# Altium project esp32-web-radio.PrjPcb
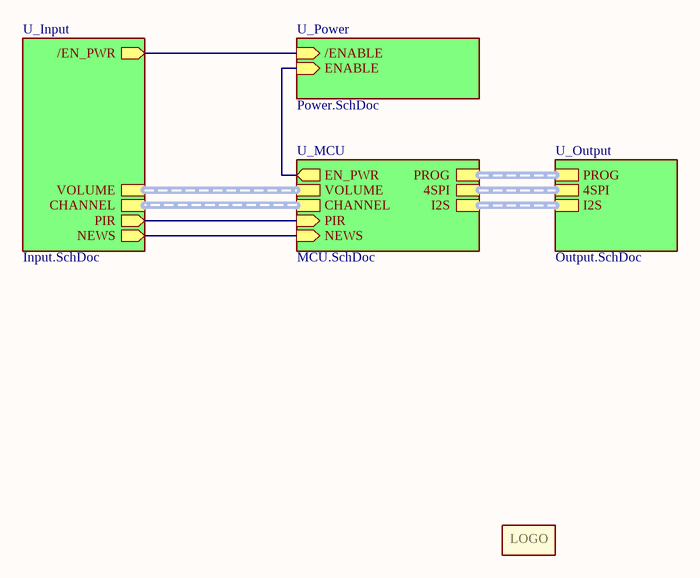
[diagram p0: Main.SchDoc]
assembly_revision: 0; board_name: WEBRAD; board_revision: 1.1; Project_link: https://github.com/LieBtrau/esp32-web-radio
5 sheets, 118 parts. Net scope: hierarchical (ports join the sheet entries above them; power ports are global).
Board file: esp32-web-radio.PcbDoc
Sheets:
  Main.SchDoc
    U_Input = Input.SchDoc
    U_MCU = MCU.SchDoc
    U_Output = Output.SchDoc
    U_Power = Power.SchDoc

## Sheet Main.SchDoc: Top level
size A4; Engineer: CT; SheetNumber: 1; SheetTotal: 5

### Parts
M1  Logo  [LOGO_9x6mm]  (value not drawn)  (no BOM)

### Sub-sheets
U_Input = Input.SchDoc: /EN_PWR (out), VOLUME (harness ROTENC), CHANNEL (harness ROTENC), PIR (out), NEWS (out)
U_MCU = MCU.SchDoc: 4SPI (harness 4SPI), PROG (harness PROG), VOLUME (harness ROTENC), CHANNEL (harness ROTENC), PIR (in), EN_PWR (out), NEWS (in), I2S (harness I2S)
U_Output = Output.SchDoc: PROG (harness PROG), 4SPI (harness 4SPI), I2S (harness I2S)
U_Power = Power.SchDoc: /ENABLE (in), ENABLE (in)

### Nets
/EN_PWR: sheet U_Input//EN_PWR, sheet U_Power//ENABLE
EN_PWR: sheet U_MCU/EN_PWR, sheet U_Power/ENABLE
NEWS: sheet U_Input/NEWS, sheet U_MCU/NEWS
PIR: sheet U_Input/PIR, sheet U_MCU/PIR

### Buses and harness runs
harness sheet U_Input/CHANNEL = sheet U_MCU/CHANNEL
harness sheet U_Input/VOLUME = sheet U_MCU/VOLUME
harness sheet U_MCU/4SPI = sheet U_Output/4SPI
harness sheet U_MCU/I2S = sheet U_Output/I2S
harness sheet U_MCU/PROG = sheet U_Output/PROG

### Notes on the sheet
- Title
- Sheet Revision:
- Link:
- Size:
- Project:
- Engineer:
- A4
- Date:
- Sheet
- of
- File:
- (in symbol Logo) LOGO

## Sheet Input.SchDoc: Inputs
size A4; Engineer: CT; SheetNumber: 5; SheetTotal: 5
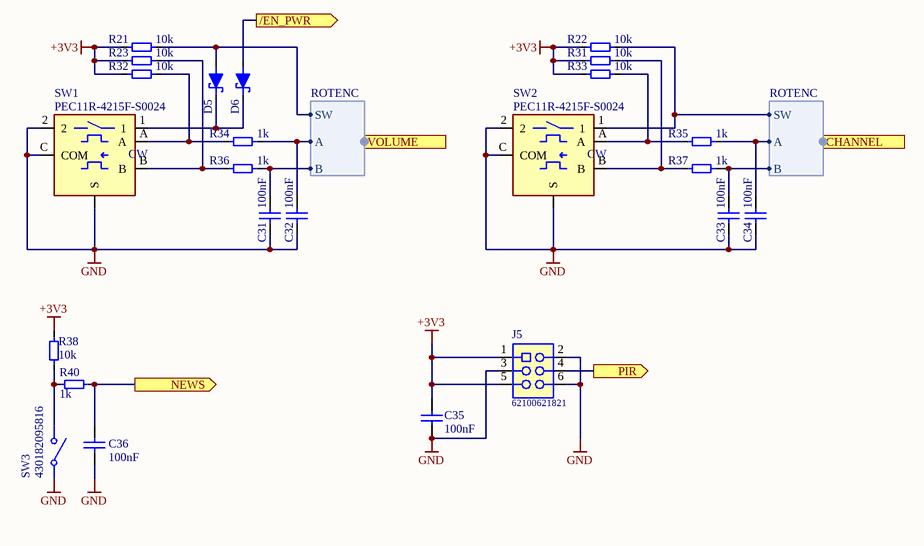
[diagram p1: Input.SchDoc]

### Parts
C31  value 100nF  [0603-C-N]  (hidden comment: Capacitor 100nF +/-10% 50V X7R 0603)
C32  value 100nF  [0603-C-N]  (hidden comment: Capacitor 100nF +/-10% 50V X7R 0603)
C33  value 100nF  [0603-C-N]  (hidden comment: Capacitor 100nF +/-10% 50V X7R 0603)
C34  value 100nF  [0603-C-N]  (hidden comment: Capacitor 100nF +/-10% 50V X7R 0603)
C35  value 100nF  [0603-C-N]  (hidden comment: Capacitor 100nF +/-10% 50V X7R 0603)
C36  value 100nF  [0603-C-N]  (hidden comment: Capacitor 100nF +/-10% 50V X7R 0603)
D5  1PS79SB30,115  [FP-SOD523-MFG]  (value not drawn)
D6  1PS79SB30,115  [FP-SOD523-MFG]  (value not drawn)
J5  62100621821  [62100621821]
R21  value 10k  [0603-R-N]  (hidden comment: Resistor 10k +/-1% 50V 0603)
R22  value 10k  [0603-R-N]  (hidden comment: Resistor 10k +/-1% 50V 0603)
R23  value 10k  [0603-R-N]  (hidden comment: Resistor 10k +/-1% 50V 0603)
R31  value 10k  [0603-R-N]  (hidden comment: Resistor 10k +/-1% 50V 0603)
R32  value 10k  [0603-R-N]  (hidden comment: Resistor 10k +/-1% 50V 0603)
R33  value 10k  [0603-R-N]  (hidden comment: Resistor 10k +/-1% 50V 0603)
R34  value 1k  [0603-R-N]  (hidden comment: Resistor 1k +/-1% 50V 0603)
R35  value 1k  [0603-R-N]  (hidden comment: Resistor 1k +/-1% 50V 0603)
R36  value 1k  [0603-R-N]  (hidden comment: Resistor 1k +/-1% 50V 0603)
R37  value 1k  [0603-R-N]  (hidden comment: Resistor 1k +/-1% 50V 0603)
R38  value 10k  [0603-R-N]  (hidden comment: Resistor 10k +/-1% 50V 0603)
R40  value 1k  [0603-R-N]  (hidden comment: Resistor 1k +/-1% 50V 0603)
SW1  PEC11R-4215F-S0024  [PEC11R-4215F-S0024]
SW2  PEC11R-4215F-S0024  [PEC11R-4215F-S0024]
SW3  430182095816  [WS-TASV_L6W6H9.5_4301x20958x6]

### Ports
/EN_PWR (out), CHANNEL (harness ROTENC), NEWS (out), PIR (out), VOLUME (harness ROTENC)

### Harnesses
ROTENC: SW, A, B

### Nets
+3V3: C35.2 J5.1 J5.5 R21.1 R22.1 R23.2 R31.2 R32.2 R33.2 R38.2
GND: C31.1 C32.1 C33.1 C34.1 C35.1 C36.1 J5.2 J5.3 J5.6 SW1.2 SW1.C(COM) SW1.S SW2.2 SW2.C(COM) SW2.S SW3.1
/EN_PWR: D6.2(A) ; port /EN_PWR
NEWS: C36.2 R40.2 ; port NEWS
PIR: J5.4 ; port PIR
NetC31_2: C31.2 R36.2 ; port VOLUME.B
NetC32_2: C32.2 R34.2 ; port VOLUME.A
NetC33_2: C33.2 R37.2 ; port CHANNEL.B
NetC34_2: C34.2 R35.2 ; port CHANNEL.A
NetD5_1: D5.1(K) D6.1(K) SW1.1
NetD5_2: D5.2(A) R21.2 ; port VOLUME.SW
NetHY1_4: R22.2 SW2.1 ; port CHANNEL.SW
NetR23_1: R23.1 R36.1 SW1.B
NetR31_1: R31.1 R37.1 SW2.B
NetR32_1: R32.1 R34.1 SW1.A
NetR33_1: R33.1 R35.1 SW2.A
NetR38_1: R38.1 R40.1 SW3.2

### Notes on the sheet
- Title
- Sheet Revision:
- Link:
- Size:
- Project:
- Engineer:
- A4
- Date:
- Sheet
- of
- File:
- (in symbol CMP-011-00021-3) CW

### Library data of the parts
C31-C34 C36 = CMP-072-000620-12: WCAP-CSGP Multilayer Ceramic Chip Capacitor, General Purpose, size 0603, X7R, 100nF, 50VDC; Capacitor Type: MLCC; Tolerance: 10%; Dissipation Factor: 3%; Technical Reference: X7R0603104K050DFCT20000; Insulation Resistance: 5GO; Voltage Rating: 50V; Mounting Technology: SMT; Max Operating Temperature: 125°C; Length: 1.6mm; Case/Package: 0603; JLCPCB Part #: C14663; Min Operating Temperature: -55°C; Usage: General Purpose; Packaging: Tape and Reel; Width: 0.8mm; Height: 0.8mm; Dielectric: X7R; Pins: 2; Match Code: WCAP-CSGP; Source: WCAP-CSGP.SchLib; Design Item ID: 885012206095R; ComponentLink2Description: Datasheet Link; ComponentLink1URL: https://www.we-online.com/redexpert/article/885012206095R?ad; ComponentLink1Description: Website Link; ComponentLink2URL: https://www.we-online.com/redexpert/spec/885012206095R?ad
C35 = CMP-072-000619-13: WCAP-CSGP Multilayer Ceramic Chip Capacitor, General Purpose, size 0603, X7R, 100nF, 50VDC; Capacitor Type: MLCC; Tolerance: 10%; Dissipation Factor: 3%; Technical Reference: X7R0603104K050DFCT10000; Insulation Resistance: 5GO; Length: 1.6mm; Dielectric: X7R; Height: 0.8mm; Pins: 2; Min Operating Temperature: -55°C; Usage: General Purpose; Mounting Technology: SMT; Case/Package: 0603; Width: 0.8mm; Max Operating Temperature: 125°C; Voltage Rating: 50V; Design Item ID: 885012206095; ComponentLink1URL: https://www.we-online.com/redexpert/article/885012206095?ad; ComponentLink2URL: https://www.we-online.com/redexpert/spec/885012206095?ad; Packaging: Tape and Reel; ComponentLink1Description: Website Link; Match Code: WCAP-CSGP; ComponentLink2Description: Datasheet Link; Source: WCAP-CSGP.SchLib; JLCPCB Part #: C14663
D5 D6 = CMP-004-00048-7: VR=40V IF=200mA 20pF; Forward Voltage: 600 mV @ 200 mA; Forward Current: 200mA; Max Repetitive Reverse Voltage (Vrrm): 40V; Case/Package: SOD-523; JLCPCB Part #: C426690; RoHS Compliant: Yes
J5 = CMP-045-000366-5: WR-PHD Socket Header, SMT, pitch 2mm, Dual Row, Vertical, 6p; Manufacturer: Wurth Elektronik; Pin Number: 6; Working Voltage: 250VAC; Contact Resistance: 20mOhm; Withstanding Voltage: 500VAC; Rated Current: 2A; Orientation: Vertical; Design Item ID: 62100621821; ComponentLink2Description: Datasheet; ComponentLink1URL: http://www.we-online.de; Operating Temperature: -40 to +105degC; ComponentLink1Description: Manufacturer; Row Number: Dual; Pitch: 2mm; Component Type: Standard; Gender: Socket Header; Pin Count: 6; Mounting Technology: SMT; Packaging: Tube; Source: WR-PHD_Socket Header.SchLib; ComponentLink2URL: https://www.we-online.com/catalog/datasheet/62100621821.pdf; Manufacturer Part Number: 62100621821; JLCPCB Part #: -
R21-R23 R31-R33 R38 = CMP-009-00017-23: Chip Resistor, Thick Film, General Purpose, 0603, 100mW, 50V, 10 kOhm, +/-1%; Tolerance: 1%; Elements: 1; Power Rating: 100mW; RoHS Compliant: True; Voltage Rating: 50V; Mounting Technology: SMT; Usage: General Purpose; JLCPCB Part #: C25804; Max Operating Temperature: 155°C; Case/Package: 0603; Pins: 2; Resistor Type: Thick Film; Min Operating Temperature: -55°C
R34-R37 R40 = CMP-009-00014-24: Chip Resistor, Thick Film, General Purpose, 0603, 100mW, 50V, 1 kOhm, +/-1%; Tolerance: 1%; Elements: 1; Power Rating: 100mW; RoHS Compliant: True; Voltage Rating: 50V; Mounting Technology: SMT; Usage: General Purpose; JLCPCB Part #: C21190; Max Operating Temperature: 155°C; Case/Package: 0603; Pins: 2; Resistor Type: Thick Film; Min Operating Temperature: -55°C
SW1 SW2 = CMP-011-00021-3: Incremental Encoder 24 PPR 2 Bit Quadrature 5VDC at 10 mA IP40 PCB Mount 60RPM; pin to pad: S>S1+S2; Electrical Life Switch: 20000Cycles; Detent: Yes; Electrical Life Encoder: 15000Cycles; Insulation Resistance: 100MO; Operating Temperature Max: 85°C; Category: Encoder Switches; Component Type: Standard; Height: 13.4mm; Operating Temperature Min: -40°C; Mount: Through Hole; JLCPCB Part #: C143790
SW3 = CMP-002-000146-2: WS-TASV SMT Tact Switch, 12VDC, 50mA, 160g, height 9.5mm; pin to pad: 1>1+3 2>2+4; Manufacturer: Wurth Elektronik; Washable: No; Rated Voltage: 12V; Electrical Life: 1000000Cycles; Actuator Color: Black; Mounting Technology: SMT; Manufacturer Part Number: 430182095816; Height: 9.5mm; Component Type: Standard; Contact Plating: Silver; Design Item ID: 430182095816; ComponentLink2Description: Datasheet; ComponentLink1URL: http://www.we-online.de; Packaging: Tape and Reel; ComponentLink2URL: https://www.we-online.com/catalog/datasheet/430182095816.pdf; Width: 6mm; Operating Temperature max.: 85C; Pin Count: 4; Terminal Material: Copper Alloy; JLCPCB Part #: C285487; Length: 6mm; Operating Temperature min.: -40C; Rated Current: 50mA; Contact Material: Stainless Steel; Source: WS-TASV.SchLib; Operation Force: 160g; Terminal Plating: Silver; ComponentLink1Description: Manufacturer Link

## Sheet MCU.SchDoc: ESP32 Web Radio
size A4; Engineer: CT; SheetNumber: 2; SheetTotal: 5; SPICEModelCacheVHZGYMXH: <root> / <DocumentId>VHZGYMXH</DocumentId> / </root>
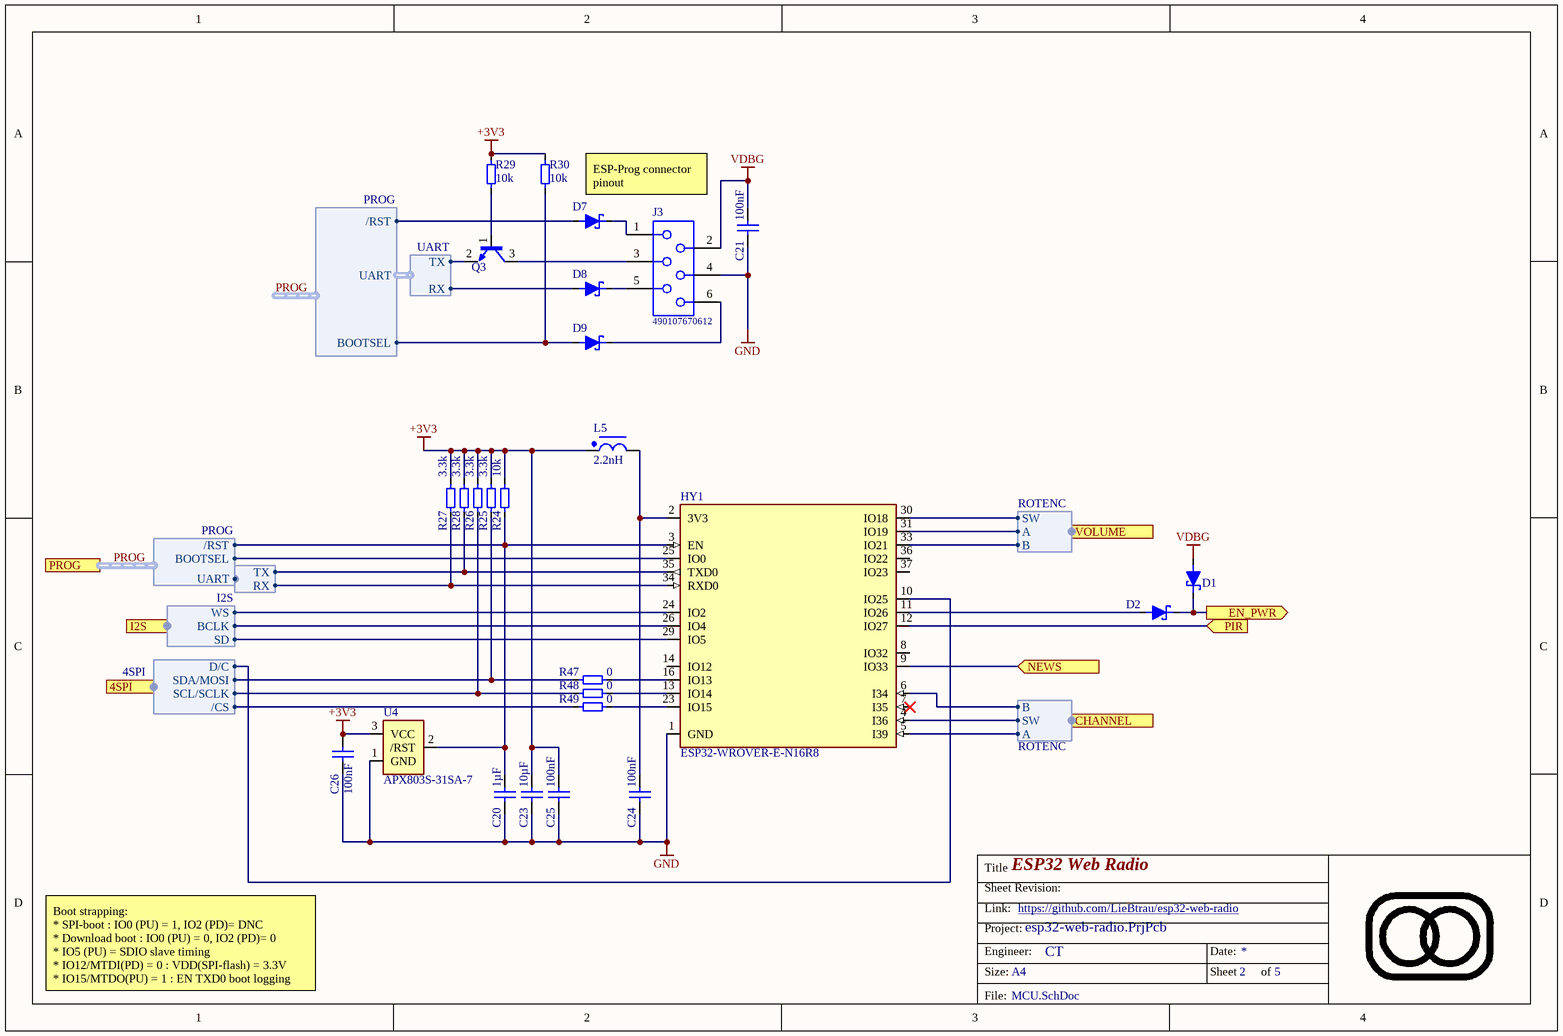
[diagram p2: MCU.SchDoc]

### Parts
C20  value 1µF  [0805-C-N]  (hidden comment: Capacitor 1µF +/-10% 10V X7R 0805)
C21  value 100nF  [0603-C-N]  (hidden comment: Capacitor 100nF +/-10% 50V X7R 0603)
C23  value 10µF  [1206-C-N]  (hidden comment: Capacitor 10µF +/-10% 10V X7R 1206)
C24  value 100nF  [0603-C-N]  (hidden comment: Capacitor 100nF +/-10% 50V X7R 0603)
C25  value 100nF  [0603-C-N]  (hidden comment: Capacitor 100nF +/-10% 50V X7R 0603)
C26  value 100nF  [0603-C-N]  (hidden comment: Capacitor 100nF +/-10% 50V X7R 0603)
D1  1PS79SB30,115  [FP-SOD523-MFG]  (value not drawn)
D2  1PS79SB30,115  [FP-SOD523-MFG]  (value not drawn)
D7  1PS79SB30,115  [FP-SOD523-MFG]  (value not drawn)
D8  1PS79SB30,115  [FP-SOD523-MFG]  (value not drawn)
D9  1PS79SB30,115  [FP-SOD523-MFG]  (value not drawn)
HY1  value ESP32-WROVER-E-N16R8  [ESP32 _WROVER]  (hidden comment: ESP32-WROVER-E(M213EH2864PH3Q0))
J3  490107670612  [490107670612_Debugging Application]  (no BOM)
L5  value 2.2nH  [FP-LQW18AN_10-MFG]  (hidden comment: LQW18AN2N2D10D)
Q3  BC846BLT1G  [SOT-23-3-N]  (value not drawn)
R24  value 10k  [0603-R-N]  (hidden comment: Resistor 10k +/-1% 50V 0603)
R25  value 3.3k  [0603-R-N]  (hidden comment: Resistor 3.3k +/-1% 50V 0603)
R26  value 3.3k  [0603-R-N]  (hidden comment: Resistor 3.3k +/-1% 50V 0603)
R27  value 3.3k  [0603-R-N]  (hidden comment: Resistor 3.3k +/-1% 50V 0603)
R28  value 3.3k  [0603-R-N]  (hidden comment: Resistor 3.3k +/-1% 50V 0603)
R29  value 10k  [0603-R-N]  (hidden comment: Resistor 10k +/-1% 50V 0603)
R30  value 10k  [0603-R-N]  (hidden comment: Resistor 10k +/-1% 50V 0603)
R47  value 0  [0603-R-N]  (hidden comment: Jumper 0R <50 mOhm 1A 0603)
R48  value 0  [0603-R-N]  (hidden comment: Jumper 0R <50 mOhm 1A 0603)
R49  value 0  [0603-R-N]  (hidden comment: Jumper 0R <50 mOhm 1A 0603)
U4  APX803S-31SA-7  [SOT-23-3-N]

### Ports
4SPI (harness 4SPI), CHANNEL (harness ROTENC), EN_PWR (out), I2S (harness I2S), NEWS (in), PIR (in), PROG (harness PROG), VOLUME (harness ROTENC)

### Harnesses
UART: RX, TX
PROG: /RST, UART, BOOTSEL
ROTENC: SW, A, B
4SPI: SDA/MOSI, SCL/SCLK, /CS, D/C
I2S: BCLK, WS, SD

### Nets
+3V3: C23.2 C25.2 C26.1 L5.1 R24.2 R25.1 R26.1 R27.1 R28.2 R29.2 R30.2 U4.3(VCC)
GND: C20.1 C21.1 C23.1 C24.1 C25.1 C26.2 HY1.1(GND) J3.4 U4.1(GND)
VDBG: C21.2 D1.2(A) J3.2
EN_PWR: D1.1(K) D2.1(K) ; port EN_PWR
NEWS: HY1.9(IO33) ; port NEWS
PIR: HY1.12(IO27) ; port PIR
PROG./RST: C20.2 D7.2(A) HY1.3(EN) R24.1 U4.2(/RST) ; port PROG./RST
PROG.BOOTSEL: D9.2(A) HY1.25(IO0) R30.1 ; port PROG.BOOTSEL
NetC24_2: C24.2 HY1.2(3V3) L5.2
NetC31_2: HY1.33(IO21) ; port VOLUME.B
NetC32_2: HY1.31(IO19) ; port VOLUME.A
NetC33_2: HY1.6(I34) ; port CHANNEL.B
NetC34_2: HY1.5(I39) ; port CHANNEL.A
NetD2_2: D2.2(A) HY1.11(IO26)
NetD5_2: HY1.30(IO18) ; port VOLUME.SW
NetD7_1: D7.1(K) J3.1
NetD8_1: D8.1(K) J3.5
NetD8_2: D8.2(A) HY1.34(RXD0) R27.2 ; harness UART.RX
NetD9_1: D9.1(K) J3.6
NetHY1_4: HY1.4(I36) ; port CHANNEL.SW
NetHY1_10: HY1.10(IO25) ; port 4SPI.D/C
NetHY1_13: HY1.13(IO14) R48.1
NetHY1_16: HY1.16(IO13) R47.1
NetHY1_23: HY1.23(IO15) R49.1
NetHY1_24: HY1.24(IO2) ; port I2S.WS
NetHY1_26: HY1.26(IO4) ; port I2S.BCLK
NetHY1_29: HY1.29(IO5) ; port I2S.SD
NetHY1_35: HY1.35(TXD0) Q3.2(E) R28.1 ; harness UART.TX
NetJ2_8: R49.2 ; port 4SPI./CS
NetJ2_13: R26.2 R48.2 ; port 4SPI.SCL/SCLK
NetJ2_14: R25.2 R47.2 ; port 4SPI.SDA/MOSI
NetJ3_3: J3.3 Q3.3(C)
NetQ3_1: Q3.1(B) R29.1

Not connected (* = marked no-connect by the designer): HY1 7(I35)* 8(IO32) 14(IO12) 36(IO22) 37(IO23)

### Buses and harness runs
harness PROG = port PROG

### Notes on the sheet
- ESP-Prog connector pinout
- Boot strapping:
  * SPI-boot : IO0 (PU) = 1, IO2 (PD)= DNC
  * Download boot : IO0 (PU) = 0, IO2 (PD)= 0
  * IO5 (PU) = SDIO slave timing
  * IO12/MTDI(PD) = 0 : VDD(SPI-flash) = 3.3V
  * IO15/MTDO(PU) = 1 : EN TXD0 boot logging
- Title
- Sheet Revision:
- Link:
- Size:
- Project:
- Engineer:
- A4
- Date:
- Sheet
- of
- File:

### Library data of the parts
C20 = CMP-072-000659-13: WCAP-CSGP Multilayer Ceramic Chip Capacitor, General Purpose, size 0805, X7R, 1µF, 10VDC; Tolerance: 10%; Capacitor Type: MLCC; Technical Reference: X7R0805105K010DFCT10000; Dissipation Factor: 5%; Insulation Resistance: 0.5GO; Case/Package: 0805; Source: WCAP-CSGP.SchLib; Width: 1.25mm; Pins: 2; ComponentLink2Description: Datasheet Link; Packaging: Tape and Reel; Match Code: WCAP-CSGP; Voltage Rating: 10V; Dielectric: X7R; Min Operating Temperature: -55°C; Mounting Technology: SMT; Max Operating Temperature: 125°C; ComponentLink1URL: https://www.we-online.com/redexpert/article/885012207022?ad; JLCPCB Part #: C28323; Height: 1.25mm; Design Item ID: 885012207022; Usage: General Purpose; ComponentLink1Description: Website Link; ComponentLink2URL: https://www.we-online.com/redexpert/spec/885012207022?ad; Length: 2mm
C21 C24-C26 = CMP-072-000619-13: as C35 on sheet Input; Length: 1.6mm; Dielectric: X7R; Height: 0.8mm; Pins: 2; Min Operating Temperature: -55°C; Usage: General Purpose; Mounting Technology: SMT; Case/Package: 0603; Width: 0.8mm; Max Operating Temperature: 125°C; Voltage Rating: 50V; Design Item ID: 885012206095; ComponentLink1URL: https://www.we-online.com/redexpert/article/885012206095?ad; ComponentLink2URL: https://www.we-online.com/redexpert/spec/885012206095?ad; Packaging: Tape and Reel; ComponentLink1Description: Website Link; Match Code: WCAP-CSGP; ComponentLink2Description: Datasheet Link; Source: WCAP-CSGP.SchLib; JLCPCB Part #: C14663
C23 = CMP-072-000777-12: WCAP-CSGP Multilayer Ceramic Chip Capacitor, General Purpose, size 1206, X7R, 10µF, 10VDC; Dissipation Factor: 10%; Insulation Resistance: 0.01GO; Capacitor Type: MLCC; Technical Reference: X7R1206106K010DFCT10000; Width: 1.6mm; Source: WCAP-CSGP.SchLib; ComponentLink2URL: https://www.we-online.com/redexpert/spec/885012208018?ad; Tolerance: 10%; Packaging: Tape and Reel; Voltage Rating: 10V; ComponentLink2Description: Datasheet Link; Usage: General Purpose; Design Item ID: 885012208018; Pins: 2; Max Operating Temperature: 125°C; Height: 1.6mm; ComponentLink1URL: https://www.we-online.com/redexpert/article/885012208018?ad; Dielectric: X7R; Case/Package: 1206; ComponentLink1Description: Website Link; Min Operating Temperature: -55°C; Length: 3.2mm; Match Code: WCAP-CSGP; Mounting Technology: SMT; JLCPCB Part #: C97953
D1 D2 D7-D9 = CMP-004-00048-7: as D5 on sheet Input; Case/Package: SOD-523; JLCPCB Part #: C426690; RoHS Compliant: Yes
HY1 = CMP-019-000003-20: old part nr : M213EH2864PH3Q0, new part nr : ESP32-WROVER-E-N16R8; pin to pad: 1>1+15+38+39; Component Type: Standard; Pin Count: 39; Source: 7c7_Modules.SchLib; Design Item ID: ESP32_WROVER; JLCPCB Part #: C529589
J3 = CMP-002-000028-9: WR-WST REDFIT IDC SKEDD, pitch 2.54mm, 6pins; Contact Resistance max.: 10mOhm; Gender: Transition; Rated Current: 1A; Pin Number: 6; Working Voltage: 100V(AC); Connector Type: Cable,IDC; Design Item ID: 490107670612; Source: WR-WST.SchLib; Packaging: Tube; ComponentLink2Description: Datasheet; Part Number: 490107670612; ComponentLink1Description: Manufacturer; Operating Temperature: -25 to +105degC; Pitch: 2.54mm; ComponentLink1URL: http://www.we-online.de; Published Date: November 2019; Mounting Technology: Press-In; Publisher: Wurth Elektronik; ComponentLink2URL: https://katalog.we-online.com/em/datasheet/490107670612.pdf; RoHS Compliant: Yes; Contact Plating: Gold; Series: REDFIT WR-WST
L5 = CMP-006-00039-1: Inductor RF Chip Wirewound 2.2nH 0.5nH 100MHz 25Q-Factor 1.4A 18mOhm DCR 0603 Paper T/R; Q Factor: 25; Self Resonant Frequency: 18GHz; Current: 1A; DC Resistance (DCR): 18mR; Shielding: Unshielded; Core Material: Non-Magnetic,Air; Weight: 0.000106oz; Case/Package: 0603; Mounting Technology: Surface Mount; Package Quantity: 1; Lead Free: Lead Free; Case Code (Imperial): 0603; Test Frequency: 100MHz; Width: 0.8mm; Min Operating Temperature: -55°C; Depth: 1.1mm; Termination: SMD/SMT; Series: LQW18A_10; Max Operating Temperature: 125°C; DC Current: 1.4A; JLCPCB Part #: C701164; Length: 1.6mm; Max Current Rating: 1.4A; Packaging: Tape and Reel; Case Code (Metric): 1608; RoHS Compliant: Yes; Radiation Hardening: No; Height: 0.8mm; Military Standard: Not; Max DC Current: 1.4A
Q3 = CMP-013-00048-14: NPN Ic=100mA Vceo=65V hfe=200~450 P=225mW SOT-23; Ic Max: 100mA; Vce Max: 65V; Transistor Type: NPN; Case/Package: SOT-23-3; JLCPCB Part #: C82477
R24 R29 R30 = CMP-009-00017-23: as R21 on sheet Input; Power Rating: 100mW; RoHS Compliant: True; Voltage Rating: 50V; Mounting Technology: SMT; Usage: General Purpose; JLCPCB Part #: C25804; Max Operating Temperature: 155°C; Case/Package: 0603; Pins: 2; Resistor Type: Thick Film; Min Operating Temperature: -55°C
R25-R28 = CMP-009-00243-14: Chip Resistor, Thick Film, General Purpose, 0603, 100mW, 50V, 3.3 kOhm, +/-1%; Tolerance: 1%; Elements: 1; Power Rating: 100mW; Voltage Rating: 50V; RoHS Compliant: Yes; Usage: General Purpose; Max Operating Temperature: 155°C; Mounting Technology: SMT; Min Operating Temperature: -55°C; Case/Package: 0603; Pins: 2; Resistor Type: Thick Film; JLCPCB Part #: C22978
R47-R49 = CMP-009-00006-22: Chip Jumper, Thick Film, Jumper, 0603, 100mW, 1A, 0 Ohm, <50 mOhm; Tolerance: 50 mOhm; Elements: 1; Voltage Rating: 75V; Mounting Technology: SMT; Usage: Jumper; Max Operating Temperature: 155°C; Pins: 2; Case/Package: 0603; JLCPCB Part #: C21189; Current Rating: 1A; Power Rating: 100mW; RoHS Compliant: True; Min Operating Temperature: -55°C; Resistor Type: Thick Film
U4 = CMP-019-00095-1: Processor Supervisor 3.08V 1 Active Low/Open Drain 3-Pin SOT-23 T/R; Number of Voltages Monitored: 1; Reset Timeout: 140ms; Type: Simple Reset/Power-On Reset; Threshold Voltage: 3.08V; Packaging: Cut Tape; JLCPCB Part #: C129757; Case/Package: TO-236-3; Reset: Active Low; Max Operating Temperature: 85°C; RoHS Compliant: Yes; Series: -; Min Operating Temperature: -40°C; Mounting Technology: Surface Mount

## Sheet Output.SchDoc: Outputs
size A4; Engineer: CT; SheetNumber: 4; SheetTotal: 5
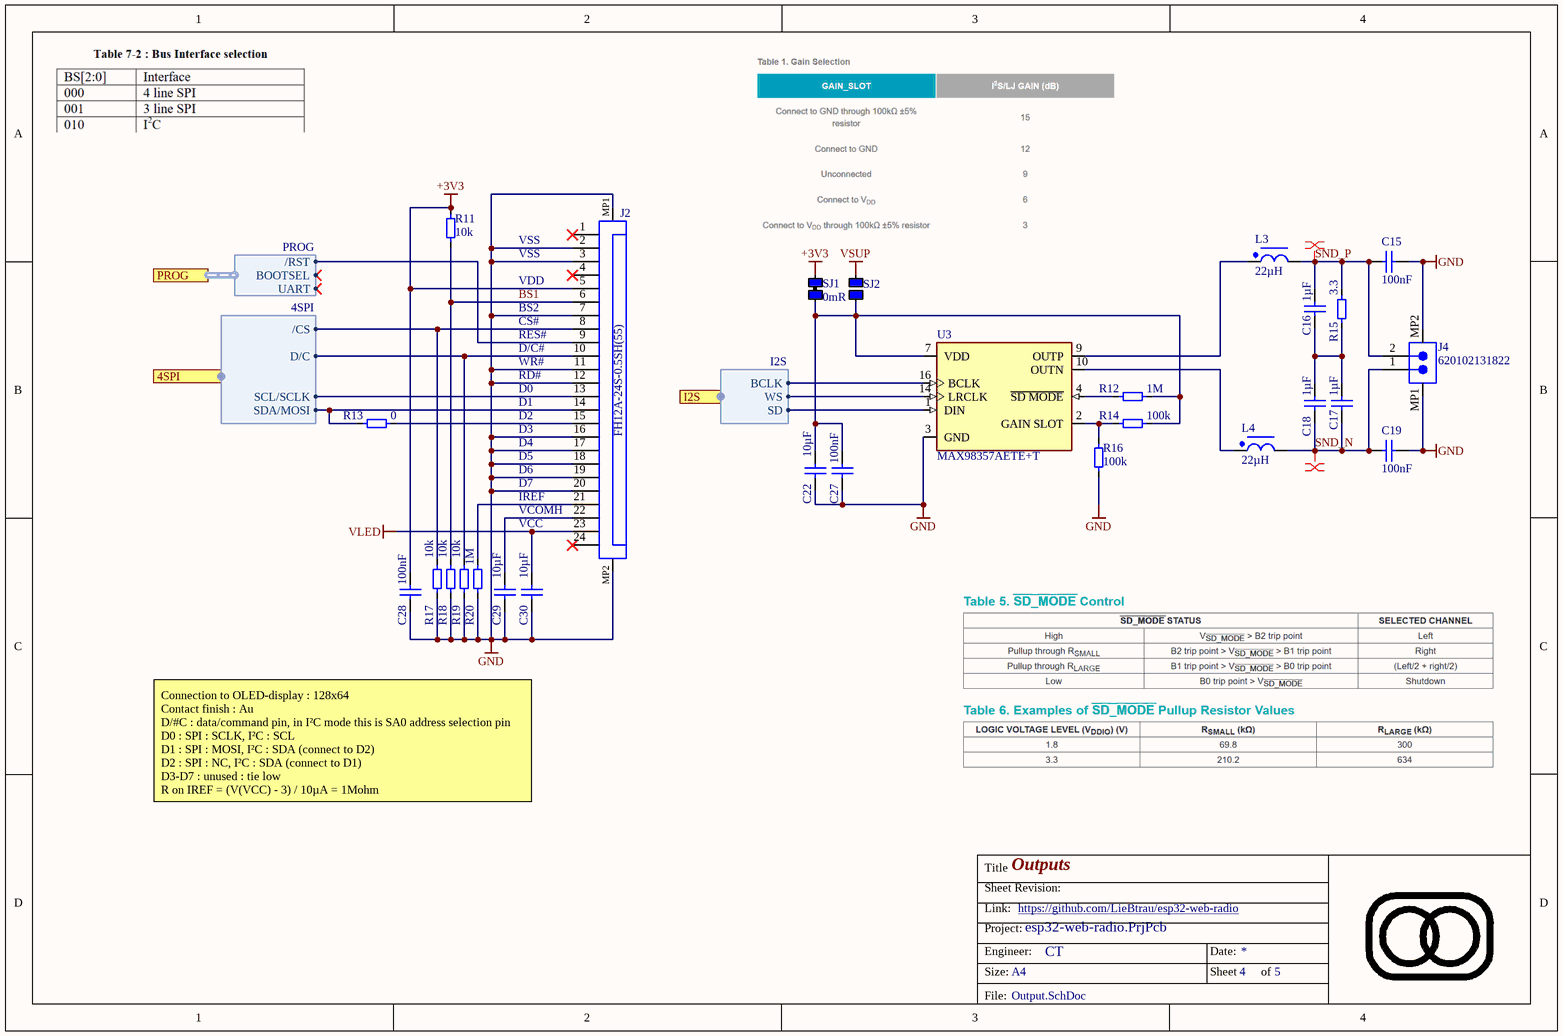
[diagram p3: Output.SchDoc]

### Parts
C15  value 100nF  [0603-C-N]  (hidden comment: Capacitor 100nF +/-10% 50V X7R 0603)
C16  value 1µF  [0805-C-N]  (hidden comment: Capacitor 1µF +/-10% 10V X7R 0805)
C17  value 1µF  [0805-C-N]  (hidden comment: Capacitor 1µF +/-10% 10V X7R 0805)
C18  value 1µF  [0805-C-N]  (hidden comment: Capacitor 1µF +/-10% 10V X7R 0805)
C19  value 100nF  [0603-C-N]  (hidden comment: Capacitor 100nF +/-10% 50V X7R 0603)
C22  value 10µF  [1206-C-N]  (hidden comment: Capacitor 10µF +/-10% 10V X7R 1206)
C27  value 100nF  [0603-C-N]  (hidden comment: Capacitor 100nF +/-10% 50V X7R 0603)
C28  value 100nF  [0603-C-N]  (hidden comment: Capacitor 100nF +/-10% 50V X7R 0603)
C29  value 10µF  [WCAP-CSGP_1210_L3.2W2.5H2.5]  (hidden comment: Capacitor 10µF +/-10% 50V X7R 1210)
C30  value 10µF  [1206-C-N]  (hidden comment: Capacitor 10µF +/-10% 10V X7R 1206)
J2  FH12A-24S-0.5SH(55)  [CF20241U0R0-NH]
J4  620102131822  [620102131822]
L3  Inductance: 22µH  [WE-LQS_6028]  (hidden comment: 74404063220)
L4  Inductance: 22µH  [WE-LQS_6028]  (hidden comment: 74404063220)
R11  value 10k  [0603-R-N]  (hidden comment: Resistor 10k +/-1% 50V 0603)
R12  value 1M  [0603-R-N]  (hidden comment: Resistor 1M +/-1% 50V 0603)
R13  value 0  [0603-R-N]  (hidden comment: Jumper 0R <50 mOhm 1A 0603)
R14  value 100k  [0603-R-N]  (hidden comment: Resistor 100k +/-1% 50V 0603)
R15  value 3.3  [1206-R-N]  (hidden comment: Resistor 3.3ohm 1% 0.25W 1206)
R16  value 100k  [0603-R-N]  (hidden comment: Resistor 100k +/-1% 50V 0603)
R17  value 10k  [0603-R-N]  (hidden comment: Resistor 10k +/-1% 50V 0603)
R18  value 10k  [0603-R-N]  (hidden comment: Resistor 10k +/-1% 50V 0603)
R19  value 10k  [0603-R-N]  (hidden comment: Resistor 10k +/-1% 50V 0603)
R20  value 1M  [0603-R-N]  (hidden comment: Resistor 1M +/-1% 50V 0603)
SJ1  value 0mR  [SJ_0603_1A]  (hidden comment: SJ-0603-1A)  (net tie, no BOM)
SJ2  Solder jumper open 1A  [Solder jumper open 1A-Footprint-1]  (value not drawn)  (no BOM)
U3  MAX98357AETE+T  [TQFN16-MFG]

### Ports
4SPI (harness 4SPI), I2S (harness I2S), PROG (harness PROG)

### Harnesses
4SPI: SDA/MOSI, SCL/SCLK, /CS, D/C
PROG: /RST, UART, BOOTSEL
I2S: BCLK, WS, SD

### Nets
+3V3: C28.1 J2.5 R11.2 SJ1.2(R)
GND: C15.2 C19.2 C22.1 C27.1 C28.2 C29.1 C30.1 J2.2 J2.3 J2.7 J2.11 J2.12 J2.16 J2.17 J2.18 J2.19 J2.20 J2.MP1 J2.MP2 J4.MP1 J4.MP2 R16.1 R17.1 R18.1 R19.1 R20.1 U3.3(GND)
VLED: C30.2 J2.23
VSUP: SJ2.2(R)
BS1: J2.6 R11.1 R18.2
PROG./RST: J2.9 ; port PROG./RST
SND_N: C17.1 C18.1 C19.1 J4.1 L4.2
SND_P: C15.1 C16.2 J4.2 L3.2 R15.2
NetC16_1: C16.1 C17.2 C18.2 R15.1
NetC22_2: C22.2 C27.2 R12.1 R14.2 SJ1.1(L) SJ2.1(L) U3.7(VDD)
NetC29_2: C29.2 J2.22
NetHY1_10: J2.10 R19.2 ; port 4SPI.D/C
NetHY1_24: U3.14(LRCLK) ; port I2S.WS
NetHY1_26: U3.16(BCLK) ; port I2S.BCLK
NetHY1_29: U3.1(DIN) ; port I2S.SD
NetJ2_8: J2.8 R17.2 ; port 4SPI./CS
NetJ2_13: J2.13 ; port 4SPI.SCL/SCLK
NetJ2_14: J2.14 R13.2 ; port 4SPI.SDA/MOSI
NetJ2_15: J2.15 R13.1
NetJ2_21: J2.21 R20.2
NetL3_1: L3.1 U3.9(OUTP)
NetL4_1: L4.1 U3.10(OUTN)
NetR12_2: R12.2 U3.4(~{SD_MODE})
NetR14_1: R14.1 R16.2 U3.2(GAIN_SLOT)

Not connected (* = marked no-connect by the designer): J2 1* 4* 24*

### Layout directives
differential pair: SND_N, SND_P

### Notes on the sheet
- VSS
- VDD
- BS2
- CS#
- WR#
- RD#
- RES#
- D/C#
- D0
- D1
- D2
- D3
- D4
- D5
- D6
- D7
- IREF
- VCOMH
- VCC
- Connection to OLED-display : 128x64
  Contact finish : Au
  D/#C : data/command pin, in I²C mode this is SA0 address selection pin
  D0 : SPI : SCLK, I²C : SCL
  D1 : SPI : MOSI, I²C : SDA (connect to D2)
  D2 : SPI : NC, I²C : SDA (connect to D1)
  D3-D7 : unused : tie low
  R on IREF = (V(VCC) - 3) / 10µA = 1Mohm
- Title
- Sheet Revision:
- Link:
- Size:
- Project:
- Engineer:
- A4
- Date:
- Sheet
- of
- File:

### Library data of the parts
C15 C19 C27 C28 = CMP-072-000619-13: as C35 on sheet Input; Length: 1.6mm; Dielectric: X7R; Height: 0.8mm; Pins: 2; Min Operating Temperature: -55°C; Usage: General Purpose; Mounting Technology: SMT; Case/Package: 0603; Width: 0.8mm; Max Operating Temperature: 125°C; Voltage Rating: 50V; Design Item ID: 885012206095; ComponentLink1URL: https://www.we-online.com/redexpert/article/885012206095?ad; ComponentLink2URL: https://www.we-online.com/redexpert/spec/885012206095?ad; Packaging: Tape and Reel; ComponentLink1Description: Website Link; Match Code: WCAP-CSGP; ComponentLink2Description: Datasheet Link; Source: WCAP-CSGP.SchLib; JLCPCB Part #: C14663
C16-C18 = CMP-072-000659-13: as C20 on sheet MCU; Case/Package: 0805; Source: WCAP-CSGP.SchLib; Width: 1.25mm; Pins: 2; ComponentLink2Description: Datasheet Link; Packaging: Tape and Reel; Match Code: WCAP-CSGP; Voltage Rating: 10V; Dielectric: X7R; Min Operating Temperature: -55°C; Mounting Technology: SMT; Max Operating Temperature: 125°C; ComponentLink1URL: https://www.we-online.com/redexpert/article/885012207022?ad; JLCPCB Part #: C28323; Height: 1.25mm; Design Item ID: 885012207022; Usage: General Purpose; ComponentLink1Description: Website Link; ComponentLink2URL: https://www.we-online.com/redexpert/spec/885012207022?ad; Length: 2mm
C22 = CMP-072-000777-12: as C23 on sheet MCU; Width: 1.6mm; Source: WCAP-CSGP.SchLib; ComponentLink2URL: https://www.we-online.com/redexpert/spec/885012208018?ad; Tolerance: 10%; Packaging: Tape and Reel; Voltage Rating: 10V; ComponentLink2Description: Datasheet Link; Usage: General Purpose; Design Item ID: 885012208018; Pins: 2; Max Operating Temperature: 125°C; Height: 1.6mm; ComponentLink1URL: https://www.we-online.com/redexpert/article/885012208018?ad; Dielectric: X7R; Case/Package: 1206; ComponentLink1Description: Website Link; Min Operating Temperature: -55°C; Length: 3.2mm; Match Code: WCAP-CSGP; Mounting Technology: SMT; JLCPCB Part #: C97953
C29 = CMP-072-000922-13: WCAP-CSGP Multilayer Ceramic Chip Capacitor, General Purpose, size 1210, X7R, 10µF, 50VDC; Capacitor Type: MLCC; Dissipation Factor: 10%; Technical Reference: X7R1210106K050DFCT10000; Insulation Resistance: 0.01GO; Dielectric: X7R; ComponentLink2Description: Datasheet Link; Length: 3.2mm; Height: 2.5mm; Width: 2.5mm; Match Code: WCAP-CSGP; Usage: General Purpose; Case/Package: 1210; ComponentLink1Description: Website Link; JLCPCB Part #: C2918502; Source: WCAP-CSGP.SchLib; ComponentLink2URL: https://www.we-online.com/redexpert/spec/885012209073?ad; Min Operating Temperature: -55°C; Voltage Rating: 50V; Max Operating Temperature: 125°C; Tolerance: 10%; Design Item ID: 885012209073; Mounting Technology: SMT; Pins: 2; Packaging: Tape and Reel; ComponentLink1URL: https://www.we-online.com/redexpert/article/885012209073?ad
C30 = CMP-072-000777-12: WCAP-CSGP Multilayer Ceramic Chip Capacitor, General Purpose, size 1206, X7R, 10µF, 10VDC; Capacitor Type: MLCC; Dissipation Factor: 10%; Technical Reference: X7R1206106K010DFCT10000; Insulation Resistance: 0.01GO; Dielectric: X7R; ComponentLink2Description: Datasheet Link; Length: 3.2mm; Height: 1.6mm; Width: 1.6mm; Match Code: WCAP-CSGP; Usage: General Purpose; Case/Package: 1206; ComponentLink1Description: Website Link; Source: WCAP-CSGP.SchLib; ComponentLink2URL: https://www.we-online.com/redexpert/spec/885012208018?ad; Min Operating Temperature: -55°C; Voltage Rating: 10V; Max Operating Temperature: 125°C; Tolerance: 10%; Design Item ID: 885012208018; Mounting Technology: SMT; Pins: 2; Packaging: Tape and Reel; ComponentLink1URL: https://www.we-online.com/redexpert/article/885012208018?ad; JLCPCB Part #: C97953
J2 = CMP-043-000245-3: Conn Ffc/fpc Connector Skt 24 Pos 0.5MM Solder Ra SMD T/r / Conn Ffc Top 24POS 0.50MM R/a; Actuator Material: Polyphenylene; Number of Positions: 24; Voltage Rating: 50V; Insulation Resistance: 500MR; Current Rating: 500mA; JLCPCB Part #: C506794; Flammability Rating: UL94 V-0; Contact Location: Top; Min Operating Temperature: -40°C; Package Quantity: 2000; Termination: Solder; Contact Material: Bronze; RoHS Compliant: Yes; Contact Plating: Gold; Pins: 24; Mounting Technology: Surface Mount; Pitch: 0.5mm; Packaging: Tape and Reel; Series: FH12; Max Operating Temperature: 70°C; Orientation: Right Angle; Housing Material: Polyamide
J4 = CMP-047-000040-11: WR-WTB SMT Male Horizontal Shrouded Header, pitch 2mm, 2p; Pin Number: 2; Working Voltage: 100VAC; Withstanding Voltage: 800VAC; Rated Current: 2A; Contact Resistance: 20mOhm; Pitch: 2mm; Operating Temperature: -25 to +85degC; ComponentLink1Description: Manufacturer; ComponentLink1URL: http://www.we-online.de; Gender: Male; Packaging: Tape and Reel; Pin Count: 2; Component Type: Standard; Mounting Technology: SMT; Type: Horizontal; Part Number: 620102131822; ComponentLink2Description: Datasheet; Publisher: Wurth Elektronik; Source: WR-WTB_2.00mm.SchLib; Design Item ID: 620102131822; Published Date: January 2020; JLCPCB Part #: C295747; ComponentLink2URL: https://www.we-online.com/catalog/datasheet/620102131822.pdf
L3 L4 = CMP-002-001259-2: WE-LQS SMT Power Inductor, size 6028, 22µH, 1.4A, 0.14O; Manufacturer: Wurth Elektronik; Case/Size Code: 6028; Saturation Current: 1.6A; Self Resonant Frequency: 21MHz; DC Resistance: 0.14O; Match Code: WE-LQS; Rated Current: 1.4A; ComponentLink2Description: Datasheet Link; Category: Shielded Power Inductors; Manufacturer Part Number: 74404063220; Component Type: Standard; Pin Count: 2; JLCPCB Part #: C668454; Height: 2.8mm; Source: WE-LQS.SchLib; ComponentLink2URL: https://www.we-online.com/redexpert/spec/74404063220?ad; ComponentLink1URL: https://www.we-online.com/redexpert/article/74404063220?ad; ComponentLink1Description: Website Link; Design Item ID: 74404063220; Packaging: Tape and Reel; Width: 6mm; Operating Temperature Min: -40°C; Mount: Surface Mount; Length: 6mm; Operating Temperature Max: 125°C
R11 R17-R19 = CMP-009-00017-23: as R21 on sheet Input; Power Rating: 100mW; RoHS Compliant: True; Voltage Rating: 50V; Mounting Technology: SMT; Usage: General Purpose; JLCPCB Part #: C25804; Max Operating Temperature: 155°C; Case/Package: 0603; Pins: 2; Resistor Type: Thick Film; Min Operating Temperature: -55°C
R12 R20 = CMP-009-00234-14: Chip Resistor, Thick Film, General Purpose, 0603, 100mW, 50V, 1 MOhm, +/-1%; Elements: 1; Tolerance: 1%; Voltage Rating: 50V; Max Operating Temperature: 155°C; Mounting Technology: SMT; Resistor Type: Thick Film; RoHS Compliant: Yes; Power Rating: 100mW; Usage: General Purpose; Pins: 2; Min Operating Temperature: -55°C; JLCPCB Part #: C22935; Case/Package: 0603
R13 = CMP-009-00006-22: as R47 on sheet MCU; Mounting Technology: SMT; Usage: Jumper; Max Operating Temperature: 155°C; Pins: 2; Case/Package: 0603; JLCPCB Part #: C21189; Current Rating: 1A; Power Rating: 100mW; RoHS Compliant: True; Min Operating Temperature: -55°C; Resistor Type: Thick Film
R14 R16 = CMP-009-00023-24: Chip Resistor, Thick Film, General Purpose, 0603, 100mW, 50V, 100 kOhm, +/-1%; Elements: 1; Tolerance: 1%; Usage: General Purpose; Mounting Technology: SMT; Power Rating: 100mW; Case/Package: 0603; Voltage Rating: 50V; Max Operating Temperature: 155°C; Resistor Type: Thick Film; RoHS Compliant: True; Pins: 2; Min Operating Temperature: -55°C; JLCPCB Part #: C25803
R15 = CMP-009-00346-2: Res Thick Film 1206 3.3 Ohm 1% 1/4W ±200ppm/°C Molded SMD SMD Paper T/R; Max Power Dissipation: 250mW; Min Operating Temperature: -55°C; Mounting Technology: Surface Mount; Height: 0.028inch; Features: Automotive AEC-Q200; Width: 0.063inch; JLCPCB Part #: C17945; Case Code (Metric): 3216; Tolerance: 1%; Contact Plating: Tin,Matte; Case/Package: 1206; Series: RMCF; Radiation Hardening: No; Max Operating Temperature: 155°C; Packaging: Tape and Reel; Number of Terminations: 2; Temperature Coefficient: 200ppm/°C; RoHS Compliant: Yes; Case Code (Imperial): 1206; Length: 0.126inch
SJ1 = CMP-009-00345-3: Solder jumper 0603 1A; Voltage Rating: 50V; Max Power Dissipation: 100mW; Tolerance: 1%; Temperature Coefficient: 200ppm/°C; Resistance Tolerance: 5%; Voltage Rating (AC): 200V; Package Quantity: 5000; Pins: 2; Packaging: Tape and Reel; Case/Package: 0603; Number of Terminations: 2; Series: RC; Construction: Rectangular; Reach SVHC Compliant: Unknown; Military Standard: Not; Depth: 0.8mm; JLCPCB Part #: C876125; Case Code (Metric): 1608; Lead Free: Lead Free; RoHS Compliant: Yes; Power Rating: 100mW; Height: 0.45mm; Resistor Type: Thick Film; Min Operating Temperature: -55°C; Length: 1.6mm; Technology: THICK FILM; Voltage Rating (DC): 50V; Contact Plating: Tin,Matte; Case Code (Imperial): 0603; Max Operating Temperature: 155°C; Width: 0.8mm; Features: Moisture Resistant; Termination: SMD/SMT
SJ2 = CMP-00004-3
U3 = CMP-014-00012-1: IC AUDIO AMP CLASS D 16-TQFN; pin to pad: 3>3+11+15+17 7>7+8; Power Supply Rejection Ratio (PSRR): 77dB; Voltage Gain: 15dB; Max Output Power: 3.2W; Min Supply Voltage: 2.5V; Max Supply Voltage: 5.5V; RoHS Compliant: Yes; Mounting Technology: Surface Mount; Radiation Hardening: No; Series: -; Max Operating Temperature: 85°C; Min Operating Temperature: -40°C; Pins: 16; Packaging: Tape and Reel; JLCPCB Part #: C910544

## Sheet Power.SchDoc: Power supply
size A4; Engineer: CT; SheetNumber: 3; SheetTotal: 5
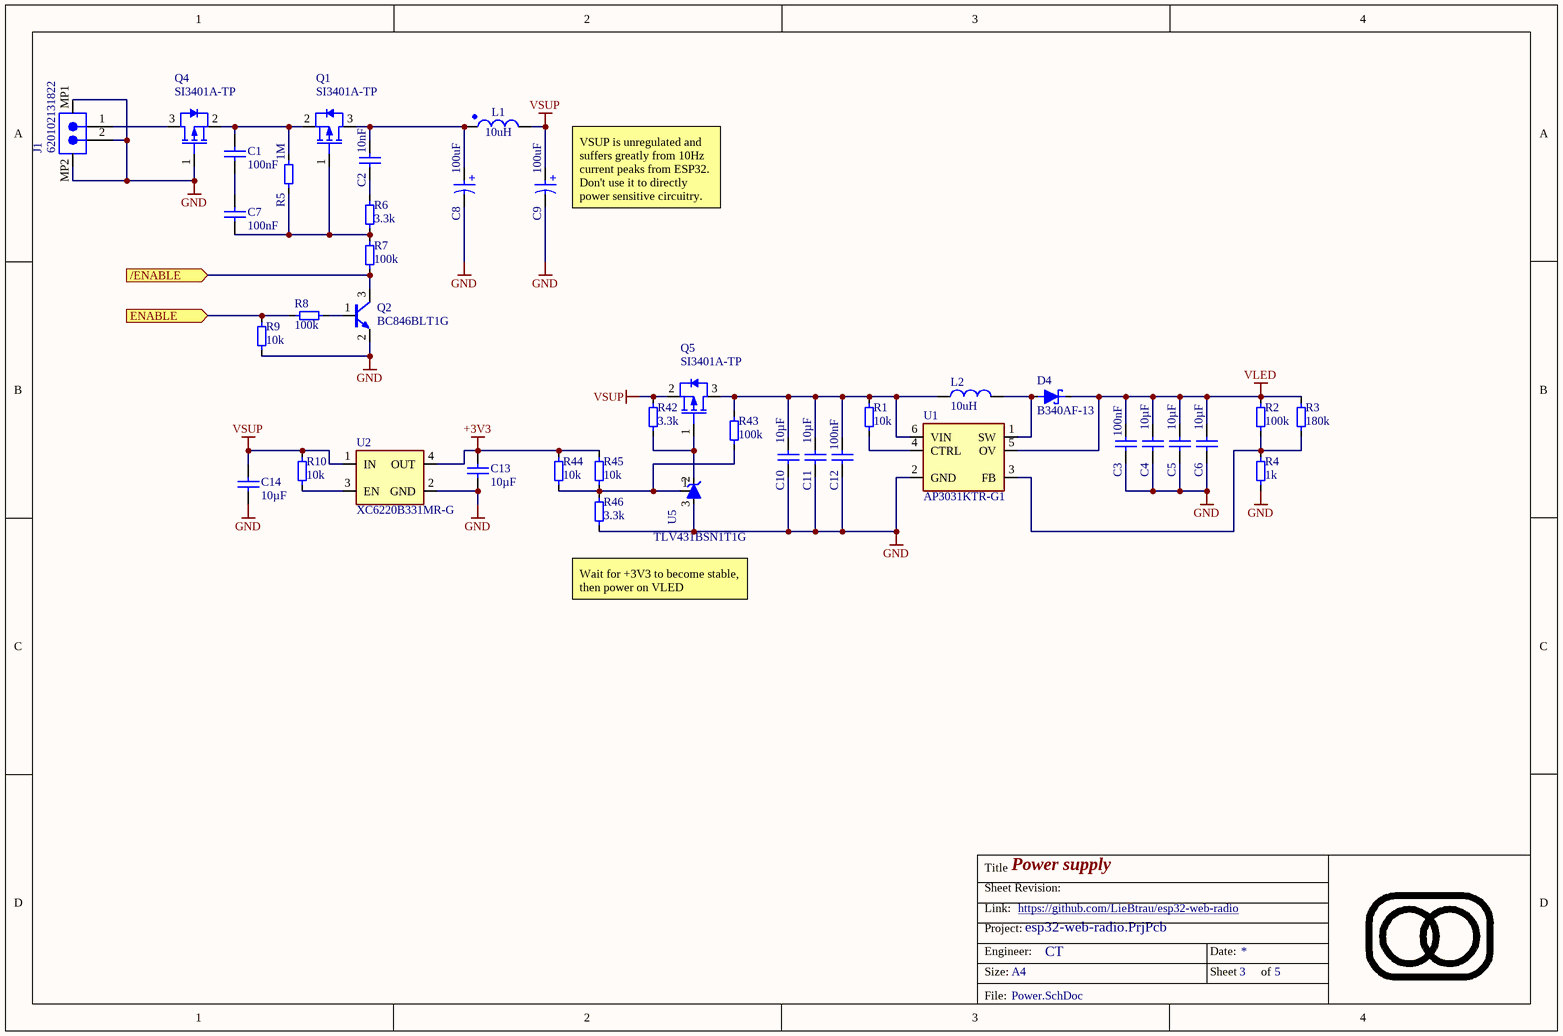
[diagram p4: Power.SchDoc]

### Parts
C1  value 100nF  [0603-C-N]  (hidden comment: Capacitor 100nF +/-10% 50V X7R 0603)
C2  value 10nF  [0603-C-N]  (hidden comment: Capacitor 10nF +/-10% 50V X7R 0603)
C3  value 100nF  [0603-C-N]  (hidden comment: Capacitor 100nF +/-10% 50V X7R 0603)
C4  value 10µF  [WCAP-CSGP_1210_L3.2W2.5H2.5]  (hidden comment: Capacitor 10µF +/-10% 50V X7R 1210)
C5  value 10µF  [WCAP-CSGP_1210_L3.2W2.5H2.5]  (hidden comment: Capacitor 10µF +/-10% 50V X7R 1210)
C6  value 10µF  [WCAP-CSGP_1210_L3.2W2.5H2.5]  (hidden comment: Capacitor 10µF +/-10% 50V X7R 1210)
C7  value 100nF  [0603-C-N]  (hidden comment: Capacitor 100nF +/-10% 50V X7R 0603)
C8  Capacitance: 100uF  [WCAP-ASLI_D6.3H5.5]  (hidden comment: 865080343009)
C9  Capacitance: 100uF  [WCAP-ASLI_D6.3H5.5]  (hidden comment: 865080343009)
C10  value 10µF  [1206-C-N]  (hidden comment: Capacitor 10µF +/-10% 10V X7R 1206)
C11  value 10µF  [1206-C-N]  (hidden comment: Capacitor 10µF +/-10% 10V X7R 1206)
C12  value 100nF  [0603-C-N]  (hidden comment: Capacitor 100nF +/-10% 50V X7R 0603)
C13  value 10µF  [1206-C-N]  (hidden comment: Capacitor 10µF +/-10% 10V X7R 1206)
C14  value 10µF  [1206-C-N]  (hidden comment: Capacitor 10µF +/-10% 10V X7R 1206)
D4  B340AF-13  [DO-214AC_UNI]
J1  620102131822  [620102131822]
L1  Inductance: 10uH  [WE-MAIA_4030]  (hidden comment: 78438357100)
L2  value 10uH  [WE-PMI_1008_L2.5W2H1.2]  (hidden comment: DFE252012F-100M=P2)
Q1  SI3401A-TP  [SOT-23-3-N]
Q2  BC846BLT1G  [SOT-23-3-N]
Q4  SI3401A-TP  [SOT-23-3-N]
Q5  SI3401A-TP  [SOT-23-3-N]
R1  value 10k  [0603-R-N]  (hidden comment: Resistor 10k +/-1% 50V 0603)
R2  value 100k  [0603-R-N]  (hidden comment: Resistor 100k +/-1% 50V 0603)
R3  value 180k  [0603-R-N]  (hidden comment: Resistor 180k +/-1% 75V 0603)
R4  value 1k  [0603-R-N]  (hidden comment: Resistor 1k +/-1% 50V 0603)
R5  value 1M  [0603-R-N]  (hidden comment: Resistor 1M +/-1% 50V 0603)
R6  value 3.3k  [0603-R-N]  (hidden comment: Resistor 3.3k +/-1% 50V 0603)
R7  value 100k  [0603-R-N]  (hidden comment: Resistor 100k +/-1% 50V 0603)
R8  value 100k  [0603-R-N]  (hidden comment: Resistor 100k +/-1% 50V 0603)
R9  value 10k  [0603-R-N]  (hidden comment: Resistor 10k +/-1% 50V 0603)
R10  value 10k  [0603-R-N]  (hidden comment: Resistor 10k +/-1% 50V 0603)
R42  value 3.3k  [0603-R-N]  (hidden comment: Resistor 3.3k +/-1% 50V 0603)
R43  value 100k  [0603-R-N]  (hidden comment: Resistor 100k +/-1% 50V 0603)
R44  value 10k  [0603-R-N]  (hidden comment: Resistor 10k +/-1% 50V 0603)
R45  value 10k  [0603-R-N]  (hidden comment: Resistor 10k +/-1% 50V 0603)
R46  value 3.3k  [0603-R-N]  (hidden comment: Resistor 3.3k +/-1% 50V 0603)
U1  AP3031KTR-G1  [SOT-23-6]
U2  XC6220B331MR-G  [SOT25-N]
U5  TLV431BSN1T1G  [SOT-23-3-N]

### Ports
/ENABLE (in), ENABLE (in)

### Nets
+3V3: C13.2 R44.2 R45.2 U2.4(OUT)
GND: C3.1 C4.1 C5.1 C6.1 C8.2(N) C9.2(N) C10.1 C11.1 C12.1 C13.1 C14.1 J1.2 J1.MP1 J1.MP2 Q2.2(E) Q4.1(GATE) R4.2 R9.1 R46.2 U1.2(GND) U2.2(GND) U5.3(A)
VLED: C3.2 C4.2 C5.2 C6.2 D4.1(K) R2.1 R3.2 U1.5(OV)
VSUP: C9.1(P) C14.2 L1.2 Q5.2(SOURCE) R10.2 R42.1 U2.1(IN)
/EN_PWR: Q2.3(C) R7.2 ; port /ENABLE
EN_PWR: R8.1 R9.2 ; port ENABLE
NetC1_1: C1.1 C7.1
NetC1_2: C1.2 Q1.2(SOURCE) Q4.2(SOURCE) R5.2
NetC2_1: C2.1 R6.1
NetC2_2: C2.2 C8.1(P) L1.1 Q1.3(DRAIN)
NetC7_2: C7.2 Q1.1(GATE) R5.1 R6.2 R7.1
NetC10_2: C10.2 C11.2 C12.2 L2.1 Q5.3(DRAIN) R1.2 R43.2 U1.6(VIN)
NetD4_2: D4.2(A) L2.2 U1.1(SW)
NetJ1_1: J1.1 Q4.3(DRAIN)
NetQ2_1: Q2.1(B) R8.2
NetQ5_1: Q5.1(GATE) R42.2 U5.2(C)
NetR1_1: R1.1 U1.4(CTRL)
NetR2_2: R2.2 R3.1 R4.1 U1.3(FB)
NetR10_1: R10.1 U2.3(EN)
NetR43_1: R43.1 R44.1 R45.1 R46.1 U5.1(rEF)

### Notes on the sheet
- (near C9) VSUP is unregulated and suffers greatly from 10Hz current peaks from ESP32.  Don't use it to directly power sensitive circuitry.
- Wait for +3V3 to become stable, then power on VLED
- Title
- Sheet Revision:
- Link:
- Size:
- Project:
- Engineer:
- A4
- Date:
- Sheet
- of
- File:
- (in symbol CMP-112-000042-5) +

### Library data of the parts
C1 C3 C7 C12 = CMP-072-000619-13: as C35 on sheet Input; Length: 1.6mm; Dielectric: X7R; Height: 0.8mm; Pins: 2; Min Operating Temperature: -55°C; Usage: General Purpose; Mounting Technology: SMT; Case/Package: 0603; Width: 0.8mm; Max Operating Temperature: 125°C; Voltage Rating: 50V; Design Item ID: 885012206095; ComponentLink1URL: https://www.we-online.com/redexpert/article/885012206095?ad; ComponentLink2URL: https://www.we-online.com/redexpert/spec/885012206095?ad; Packaging: Tape and Reel; ComponentLink1Description: Website Link; Match Code: WCAP-CSGP; ComponentLink2Description: Datasheet Link; Source: WCAP-CSGP.SchLib; JLCPCB Part #: C14663
C2 = CMP-001-00089-15: Capacitor MLCC, General Purpose, size 0603, X7R, 10nF, +/-10%, 50V; Tolerance: 10%; Voltage Rating: 50V; RoHS Compliant: True; Mounting Technology: SMT; Max Operating Temperature: 125°C; Length: 1.6mm; Capacitor Type: MLCC; Case/Package: 0603; JLCPCB Part #: C57112; Min Operating Temperature: -55°C; Usage: General Purpose; Packaging: Cut Tape; Width: 0.8mm; REACH SVHC: No SVHC; Height: 0.8mm; Dielectric: X7R; Pins: 2
C4-C6 = CMP-072-000922-13: as C29 on sheet Output; Dielectric: X7R; ComponentLink2Description: Datasheet Link; Length: 3.2mm; Height: 2.5mm; Width: 2.5mm; Match Code: WCAP-CSGP; Usage: General Purpose; Case/Package: 1210; ComponentLink1Description: Website Link; JLCPCB Part #: C2918502; Source: WCAP-CSGP.SchLib; ComponentLink2URL: https://www.we-online.com/redexpert/spec/885012209073?ad; Min Operating Temperature: -55°C; Voltage Rating: 50V; Max Operating Temperature: 125°C; Tolerance: 10%; Design Item ID: 885012209073; Mounting Technology: SMT; Pins: 2; Packaging: Tape and Reel; ComponentLink1URL: https://www.we-online.com/redexpert/article/885012209073?ad
C8 C9 = CMP-112-000042-5: WCAP-ASLI Aluminum Electrolytic Capacitor, V-Chip, D6.3 x H5.5mm, 100uF, 16V; Manufacturer: Wurth Elektronik; Endurance: 2000h; Technical Reference: ASED055101M016DVCTBB000; Ripple Current: 255mA; Dissipation Factor: 16%; Capacitance Tolerance: +/-20%; Leakage Current: 16uA; Pin Count: 2; Category: Aluminum Electrolytic Capacitors; Packaging: Tape and Reel; ComponentLink2Description: Datasheet Link; Diameter: 6.3mm; Height: 5.5mm; Match Code: WCAP-ASLI; Source: WCAP-ASLI.SchLib; Operating Temperature Min: -55°C; ComponentLink1Description: Website Link; ComponentLink1URL: https://www.we-online.com/redexpert/article/865080343009?ad; ComponentLink2URL: https://www.we-online.com/redexpert/spec/865080343009?ad; Mount: Surface Mount; Manufacturer Part Number: 865080343009; Rated Voltage (DC): 16V; Component Type: Standard; Design Item ID: 865080343009; Operating Temperature Max: 105°C; JLCPCB Part #: C111600
C10 C11 C13 C14 = CMP-072-000777-12: as C23 on sheet MCU; Width: 1.6mm; Source: WCAP-CSGP.SchLib; ComponentLink2URL: https://www.we-online.com/redexpert/spec/885012208018?ad; Tolerance: 10%; Packaging: Tape and Reel; Voltage Rating: 10V; ComponentLink2Description: Datasheet Link; Usage: General Purpose; Design Item ID: 885012208018; Pins: 2; Max Operating Temperature: 125°C; Height: 1.6mm; ComponentLink1URL: https://www.we-online.com/redexpert/article/885012208018?ad; Dielectric: X7R; Case/Package: 1206; ComponentLink1Description: Website Link; Min Operating Temperature: -55°C; Length: 3.2mm; Match Code: WCAP-CSGP; Mounting Technology: SMT; JLCPCB Part #: C97953
D4 = CMP-004-00050-4: Diode 40 V 3A Surface Mount SMAF; Forward Voltage: 500 mV @ 3 A; Max Reverse Voltage (DC): 40V; Packaging: Cut Tape; RoHS Compliant: Yes; Case/Package: SMA; Mounting Technology: Surface Mount; Forward Current: 3A; Series: -; JLCPCB Part #: C5310924
J1 = CMP-047-000040-11: as J4 on sheet Output; Pitch: 2mm; Operating Temperature: -25 to +85degC; ComponentLink1Description: Manufacturer; ComponentLink1URL: http://www.we-online.de; Gender: Male; Packaging: Tape and Reel; Pin Count: 2; Component Type: Standard; Mounting Technology: SMT; Type: Horizontal; Part Number: 620102131822; ComponentLink2Description: Datasheet; Publisher: Wurth Elektronik; Source: WR-WTB_2.00mm.SchLib; Design Item ID: 620102131822; Published Date: January 2020; JLCPCB Part #: C295747; ComponentLink2URL: https://www.we-online.com/catalog/datasheet/620102131822.pdf
L1 = CMP-116-000112-5: WE-MAIA SMT Power Inductor, size 4030, 10uH, 3.05A, 110mOhm; Manufacturer: Wurth Elektronik; Saturation Current @ 30%: 5.95A; Saturation Current @ 10%: 3A; Self Resonant Frequency: 15MHz; Case/Size Code: 4030; Width: 4.1mm; Packaging: Tape and Reel; Length: 4.1mm; JLCPCB Part #: C167879; ComponentLink2Description: Datasheet Link; ComponentLink2URL: https://www.we-online.com/redexpert/spec/78438357100?ad; Height: 3.1mm; Match Code: WE-MAIA; Design Item ID: 78438357100; Operating Temperature Max: 125°C; Mount: Surface Mount; Pin Count: 2; ComponentLink1Description: Website Link; DC Resistance Max: 110mOhm; Rated Current: 3.05A; Component Type: Standard; Automotive: Yes; Category: Power Inductors; Operating Temperature Min: -40°C; Source: WE-MAIA.SchLib; Manufacturer Part Number: 78438357100; ComponentLink1URL: https://www.we-online.com/redexpert/article/78438357100?ad
L2 = CMP-002-001561-2: Inductor Power Chip Shielded Wirewound 10uH 20% 1MHz Metal 0.95A 0.48Ohm DCR 1008 T/R; Current Rating: 950mA; Saturation Current: 1.6A; Core Material: Ferrite; DC Resistance (DCR): 480mR; Min Operating Temperature: -40°C; Shielding: Shielded; Width: 0.079inch; Series: DFE252012F; Max Operating Temperature: 125°C; Packaging: Cut Tape; Height - Seated (Max): 0.047inch; Case Code (Imperial): 1008; Test Frequency: 1MHz; Mounting Technology: Surface Mount; Case/Package: 1008; Length: 0.098inch; Case Code (Metric): 2520; Tolerance: 20%; JLCPCB Part #: C2042388
Q1 Q4 Q5 = CMP-013-00056-10: Trans Mosfet P-ch 30V 4.2A 3-PIN SOT-23 T/r; Transistor Type: PMOS; Max Power Dissipation: 400mW; Vgs(th) (Max) @ Id: -1.3V @ 250µA; Input Capacitance: 1.05nF; Rds On Max: 60mR; Series: -; JLCPCB Part #: C15127; Id - Continuous Drain Current: 4.2A; Packaging: Cut Tape; Mounting Technology: Surface Mount; Vds Max: 30V; RoHS Compliant: Yes; Min Operating Temperature: -55°C; Case/Package: SOT-23-3; Max Operating Temperature: 150°C
Q2 = CMP-013-00048-14: as Q3 on sheet MCU; Transistor Type: NPN; Case/Package: SOT-23-3; JLCPCB Part #: C82477
R1 R9 R10 R44 R45 = CMP-009-00017-23: as R21 on sheet Input; Power Rating: 100mW; RoHS Compliant: True; Voltage Rating: 50V; Mounting Technology: SMT; Usage: General Purpose; JLCPCB Part #: C25804; Max Operating Temperature: 155°C; Case/Package: 0603; Pins: 2; Resistor Type: Thick Film; Min Operating Temperature: -55°C
R2 R7 R8 R43 = CMP-009-00023-24: as R14 on sheet Output; Usage: General Purpose; Mounting Technology: SMT; Power Rating: 100mW; Case/Package: 0603; Voltage Rating: 50V; Max Operating Temperature: 155°C; Resistor Type: Thick Film; RoHS Compliant: True; Pins: 2; Min Operating Temperature: -55°C; JLCPCB Part #: C25803
R3 = CMP-009-00290-7: Res Thick Film 0603 180K Ohm 1% 0.1W(1/10W) ±100ppm/C Pad SMD T/R; Voltage Rating: 50V; Temperature Coefficient: 100ppm/°C; Max Power Dissipation: 100mW; Case Code (Metric): 1608; Termination: SMD/SMT; Width: 0.8mm; Resistance Tolerance: 1%; Packaging: Tape and Reel; Resistor Type: Thick Film; Case Code (Imperial): 0603; Working Voltage: 75V; Tolerance: 1%; Lead Free: Lead Free; JLCPCB Part #: C22827; Series: RC; Length: 1.6mm; Power Rating: 100mW; Max Operating Temperature: 155°C; Military Standard: Not; RoHS Compliant: Yes; Depth: 0.8mm; Pins: 2; Technology: THICK FILM; Construction: Rectangular; Case/Package: 0603; Number of Terminations: 2; Min Operating Temperature: -55°C; Height: 0.45mm; Package Quantity: 5000; Voltage Rating (DC): 50V; Features: Moisture Resistant
R4 = CMP-009-00014-24: as R34 on sheet Input; Power Rating: 100mW; Voltage Rating: 50V; RoHS Compliant: True; Usage: General Purpose; Max Operating Temperature: 155°C; Mounting Technology: SMT; Min Operating Temperature: -55°C; Case/Package: 0603; Pins: 2; Resistor Type: Thick Film; JLCPCB Part #: C21190
R5 = CMP-009-00234-14: as R12 on sheet Output; Voltage Rating: 50V; Max Operating Temperature: 155°C; Mounting Technology: SMT; Resistor Type: Thick Film; RoHS Compliant: Yes; Power Rating: 100mW; Usage: General Purpose; Pins: 2; Min Operating Temperature: -55°C; JLCPCB Part #: C22935; Case/Package: 0603
R6 R42 R46 = CMP-009-00243-14: as R25 on sheet MCU; Power Rating: 100mW; Voltage Rating: 50V; RoHS Compliant: Yes; Usage: General Purpose; Max Operating Temperature: 155°C; Mounting Technology: SMT; Min Operating Temperature: -55°C; Case/Package: 0603; Pins: 2; Resistor Type: Thick Film; JLCPCB Part #: C22978
U1 = CMP-002-001562-1: AP3031 Series 2.7 to 16 Vin 1.4 A White LED Step Up Converter-SOT-23-6; Frequency: 1MHz; Number of Channels: 1; Dimming: PWM; Max Output Voltage: 38V; Min Input Voltage (DC): 2.7V; Max Output current: 260mA; Topology: Boost; Operating Frequency: 1 MHz; Max Supply Current: 5mA; Output Current: 1.4A; Max Supply Voltage: 16V; Output Type: Adjustable; Mounting Technology: Surface Mount; Switching Frequency: 1MHz; RoHS Compliant: Yes; Package Quantity: 3000; Height: 1.3mm; Lead Free: Lead Free; Weight: 0.000529oz; Width: 1.7mm; JLCPCB Part #: C82636; Pins: 6; Case/Package: SOT-23-6; Number of Outputs: 1; Series: -; Packaging: Tape and Reel; Max Operating Temperature: 85°C; Max Input Voltage (DC): 16V; Output Current per Channel: 1.4A; Min Input Voltage: 2.7V; Min Operating Temperature: -40°C; Length: 3.02mm
U2 = CMP-019-00081-9: Fixed LDO 3.3V, 1%, 1A, Iq 108uA, -40°C to 85°C; pin to pad: 4>5; Min Input Voltage: 4V; Max Input Voltage: 6V; Number of Outputs: 1; Case/Package: SOT-23-5; Max Operating Temperature: 85°C; Output Type: Fixed; Output Voltage: 3.3V; Quiescent Current: 108uA; Mount: SMT; Number of Regulators: 1; Min Operating Temperature: -40°C; Accuracy: 1%; JLCPCB Part #: C86534; Output Current: 1A
U5 = CMP-019-00078-10: Adjustable Shunt Voltage Reference 1.24 - 16V; +/-0.5%; 3-Pin SOT-23; Cathode Current: 80uA; Output Current: 20mA; Max Input Voltage: 18V; Tolerance: 0.5%; Min Output Voltage: 1.24V; Reference Type: Shunt,Adjustable; Number of Channels: 1; Radiation Hardening: No; Max Operating Temperature: 85°C; Case/Package: SOT-23-3; Lead Free: Lead Free; Sink current: 20mA; Width: 1.4mm; Mount: Surface Mount; Halogen Free: Halogen Free; JLCPCB Part #: C91075; Package Quantity: 3000; RoHS Compliant: Yes; Packaging: Tape and Reel; Max Output Voltage: 16V; Length: 3.04mm; Reach SVHC Compliant: Yes; Series: -; Output Voltage: 16V; Min Operating Temperature: -40°C; Output Type: Adjustable; Number of Pins: 3; Max Output Current: 20mA; Height: 1.01mm; Reference Voltage: 1.24V; Output voltage (max): 16V; Accuracy: 0.5%

## Nets that join several sheets
+3V3: Input (10 pins), MCU (12 pins), Output (C28.1 J2.5 R11.2 SJ1.2), Power (C13.2 R44.2 R45.2 U2.4)
GND: Input (16 pins), MCU (9 pins), Output (27 pins), Power (22 pins)
VLED: Output (C30.2 J2.23), Power (8 pins)
VSUP: Output (SJ2.2), Power (7 pins)
/EN_PWR: Input (D6.2), Power (Q2.3 R7.2)
EN_PWR: MCU (D1.1 D2.1), Power (R8.1 R9.2)
NetC31_2: Input (C31.2 R36.2), MCU (HY1.33)
NetC32_2: Input (C32.2 R34.2), MCU (HY1.31)
NetC33_2: Input (C33.2 R37.2), MCU (HY1.6)
NetC34_2: Input (C34.2 R35.2), MCU (HY1.5)
NetD5_2: Input (D5.2 R21.2), MCU (HY1.30)
NetHY1_4: Input (R22.2 SW2.1), MCU (HY1.4)
NetHY1_10: MCU (HY1.10), Output (J2.10 R19.2)
NetHY1_24: MCU (HY1.24), Output (U3.14)
NetHY1_26: MCU (HY1.26), Output (U3.16)
NetHY1_29: MCU (HY1.29), Output (U3.1)
NetJ2_8: MCU (R49.2), Output (J2.8 R17.2)
NetJ2_13: MCU (R26.2 R48.2), Output (J2.13)
NetJ2_14: MCU (R25.2 R47.2), Output (J2.14 R13.2)
NEWS: Input (C36.2 R40.2), MCU (HY1.9)
PIR: Input (J5.4), MCU (HY1.12)
PROG./RST: MCU (5 pins), Output (J2.9)

## Assembly variants
I2C: not fitted C20 R18 R22 R41 R? R? U3
SPI: not fitted R8 R11 R13 R17 R19 R25 R26 R? R? R? R? R? R? R? U3